# EAGLE design 12v - 5v (EAGLE 9.5.2)
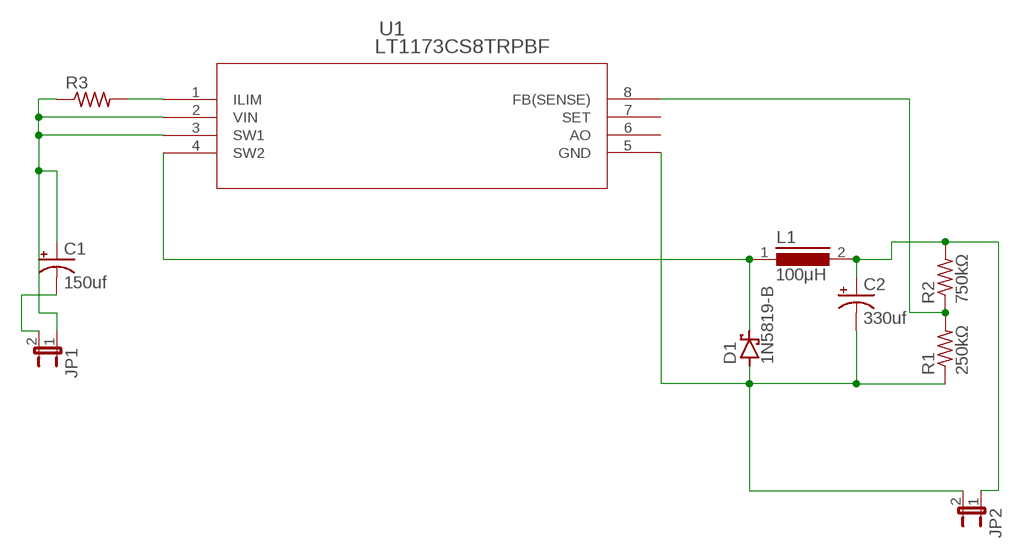
[diagram p0: schematic, sheet 1]

## Parts
C1  150uf  CPOL-USE2-5  [E2-5]
C2  330uf  CPOL-USE2-5  [E2-5]
D1  1N5819-B  [DO41-7.6]
JP1  JP1E  [JP1]
JP2  JP1E  [JP1]
L1  100μH  R1003DS11  [S11-10]
R1  250kΩ  R-US_0204/7  [0204/7]
R2  750kΩ  R-US_0204/7  [0204/7]
R3  R-US_0204/7  [0204/7]
U1  LT1173CS8TRPBF  [SOIC-8_S]

## Nets
N$2: R3.2 U1.1(ILIM)
N$3: D1.C L1.1 U1.4(SW2)
N$4: C1.- JP1.2
N$5: C2.+ JP2.1 L1.2 R2.2
N$6: C2.- D1.A JP2.2 R1.1 U1.5(GND)
N$7: R1.2 R2.1 U1.8(FB(SENSE))
N$8: C1.+ JP1.1 R3.1 U1.2(VIN) U1.3(SW1)
Unconnected: U1.6(AO) U1.7(SET)

## Library data of the parts
C1 C2 = rcl:CPOL-US: POLARIZED CAPACITOR, American symbol; SPICEPREFIX: C
D1 = diode:1N581*: 1.0A SCHOTTKY BARRIER RECTIFIER Source: http://www.diodes.com/datasheets/ds23001.pdf
JP1 JP2 = jumper:JP1E: JUMPER
L1 = inductor-nkl:R1003D: Speicherdrossel (bis typ. 250kHz) storage choke (up to typ. 250kHz); OC_FARNELL: unknown; OC_NEWARK: unknown
R1-R3 = adafruit:R-US_: RESISTOR, American symbol
U1 = LT1173CS8TRPBF:LT1173CS8TRPBF; DESCRIPTION: Buck, Boost Switching Regulator IC Positive or Negative Adjustable 1.245V 1 Output 1.5A (Switch) 8-SOIC (0.154, 3.90mm Width); DIGI-KEY_PART_NUMBER: LT1173CS8#TRPBF-ND; MF: Linear Technology/Analog; MP: LT1173CS8#TRPBF; PACKAGE: SO-8 Linear Technology

## Board
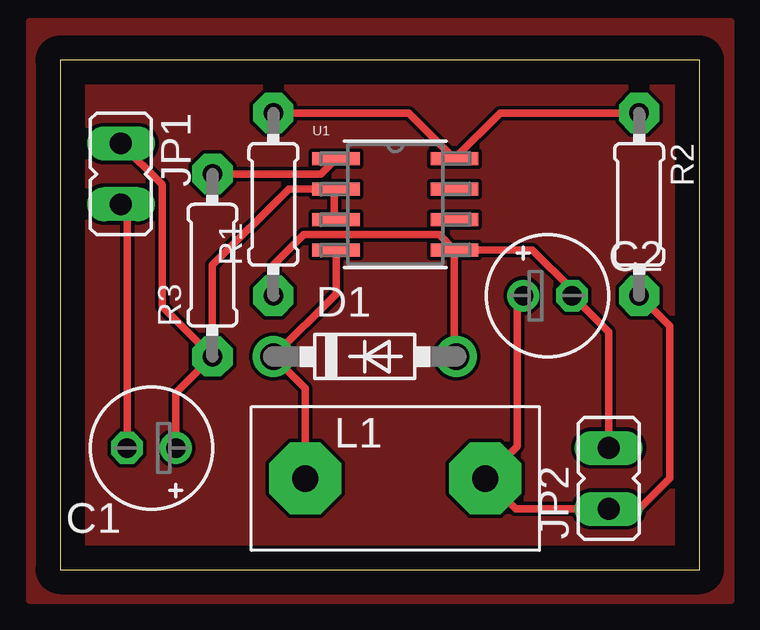
[diagram p1: board, top side]

Size 26.65 x 21.26 mm. Coordinates in mm from the lower left corner, seen from the top.
Outline: 0,0 26.65,0 26.65,21.26 0,21.26 0,0
Copper layers (1*16): Top 0.035mm / dielectric 1.5mm / Bottom 0.035mm
Design rules "default": minimum track width 6mil, minimum drill 0.35mm, track to track 6mil, track to pad 6mil, pad to pad 6mil, via to via 6mil, smd to smd 6mil, copper to edge 40mil, drill to drill 6mil, minimum pad ring 10mil, minimum via ring 8mil, stop-mask expansion 4mil, vias tented up to drill 0mil, thermal gap 10mil

### Footprints (pad centres in the part's own frame; a part is rotated, then mirrored left to right if it is on the bottom)
E2-5 = drill 0.813 pad 1.27: + -1.016,0 | drill 0.813 pad 1.27 octagon: - 1.016,0
DO41-7.6 = drill 1.1 pad 1.7: A 3.81,0; C -3.81,0
JP1 = drill 0.914 long: 1 0,-1.27; 2 0,1.27
S11-10 = drill 1.1 pad 3 octagon: 1 -3.75,0; 2 3.75,0
0204/7 = drill 0.813 pad 1.676 octagon: 1 -3.81,0; 2 3.81,0
SOIC-8_S = smd 1.981 x 0.533: 1 -2.464,1.905; 2 -2.464,0.635; 3 -2.464,-0.635; 4 -2.464,-1.905; 5 2.464,-1.905; 6 2.464,-0.635; 7 2.464,0.635; 8 2.464,1.905

### Placement (x,y rotation side)
C1  3.81,5.08 180 top
C2  20.32,11.43 0 top
D1  12.7,8.89 0 top
JP1  2.54,16.51 180 top
JP2  22.86,3.81 0 top
L1  13.97,3.81 0 top
R1  8.89,15.24 90 top
R2  24.13,15.24 270 top
R3  6.35,12.7 90 top
U1  13.97,15.24 0 top

### Tracks (layer width: path | path; a pad name or v marks a point on that pad's centre or on a via)
GND
  pour Top: -1.27,22.86 -1.27,-1.27 27.94,-1.27 27.94,22.86
N$2
  Top 0.305: U1.1 10.87,16.51 R3.2
N$3
  Top 0.305: U1.4 11.51,11.51 D1.C 10.22,7.56 L1.1
N$4
  Top 0.305: JP1.2 2.79,14.99 C1.-
N$5
  Top 0.305: R2.2 25.4,10.16 25.4,3.81 24.13,2.54 JP2.1 18.99,2.54 L1.2 19.05,5.14 19.05,8.89 19.05,9.14 19.05,11.18 C2.+
N$6
  Top 0.305: U1.5 16.43,8.97 D1.A | U1.5 19.68,13.34 21.34,11.68 C2.- 22.86,9.91 JP2.2 | R1.1 8.89,12.7 10.16,13.97 15.8,13.97 U1.5
N$7
  Top 0.305: R1.2 14.53,19.05 U1.8 18.34,19.05 R2.1
N$8
  Top 0.305: U1.3 11.43,14.61 11.43,15.8 U1.2 9.53,15.88 6.35,12.7 R3.1 | R3.1 4.83,7.37 C1.+ | JP1.1 4.27,16.05 4.27,10.97 R3.1